# EAGLE design MystiqueJamma (EAGLE 9.1.0)
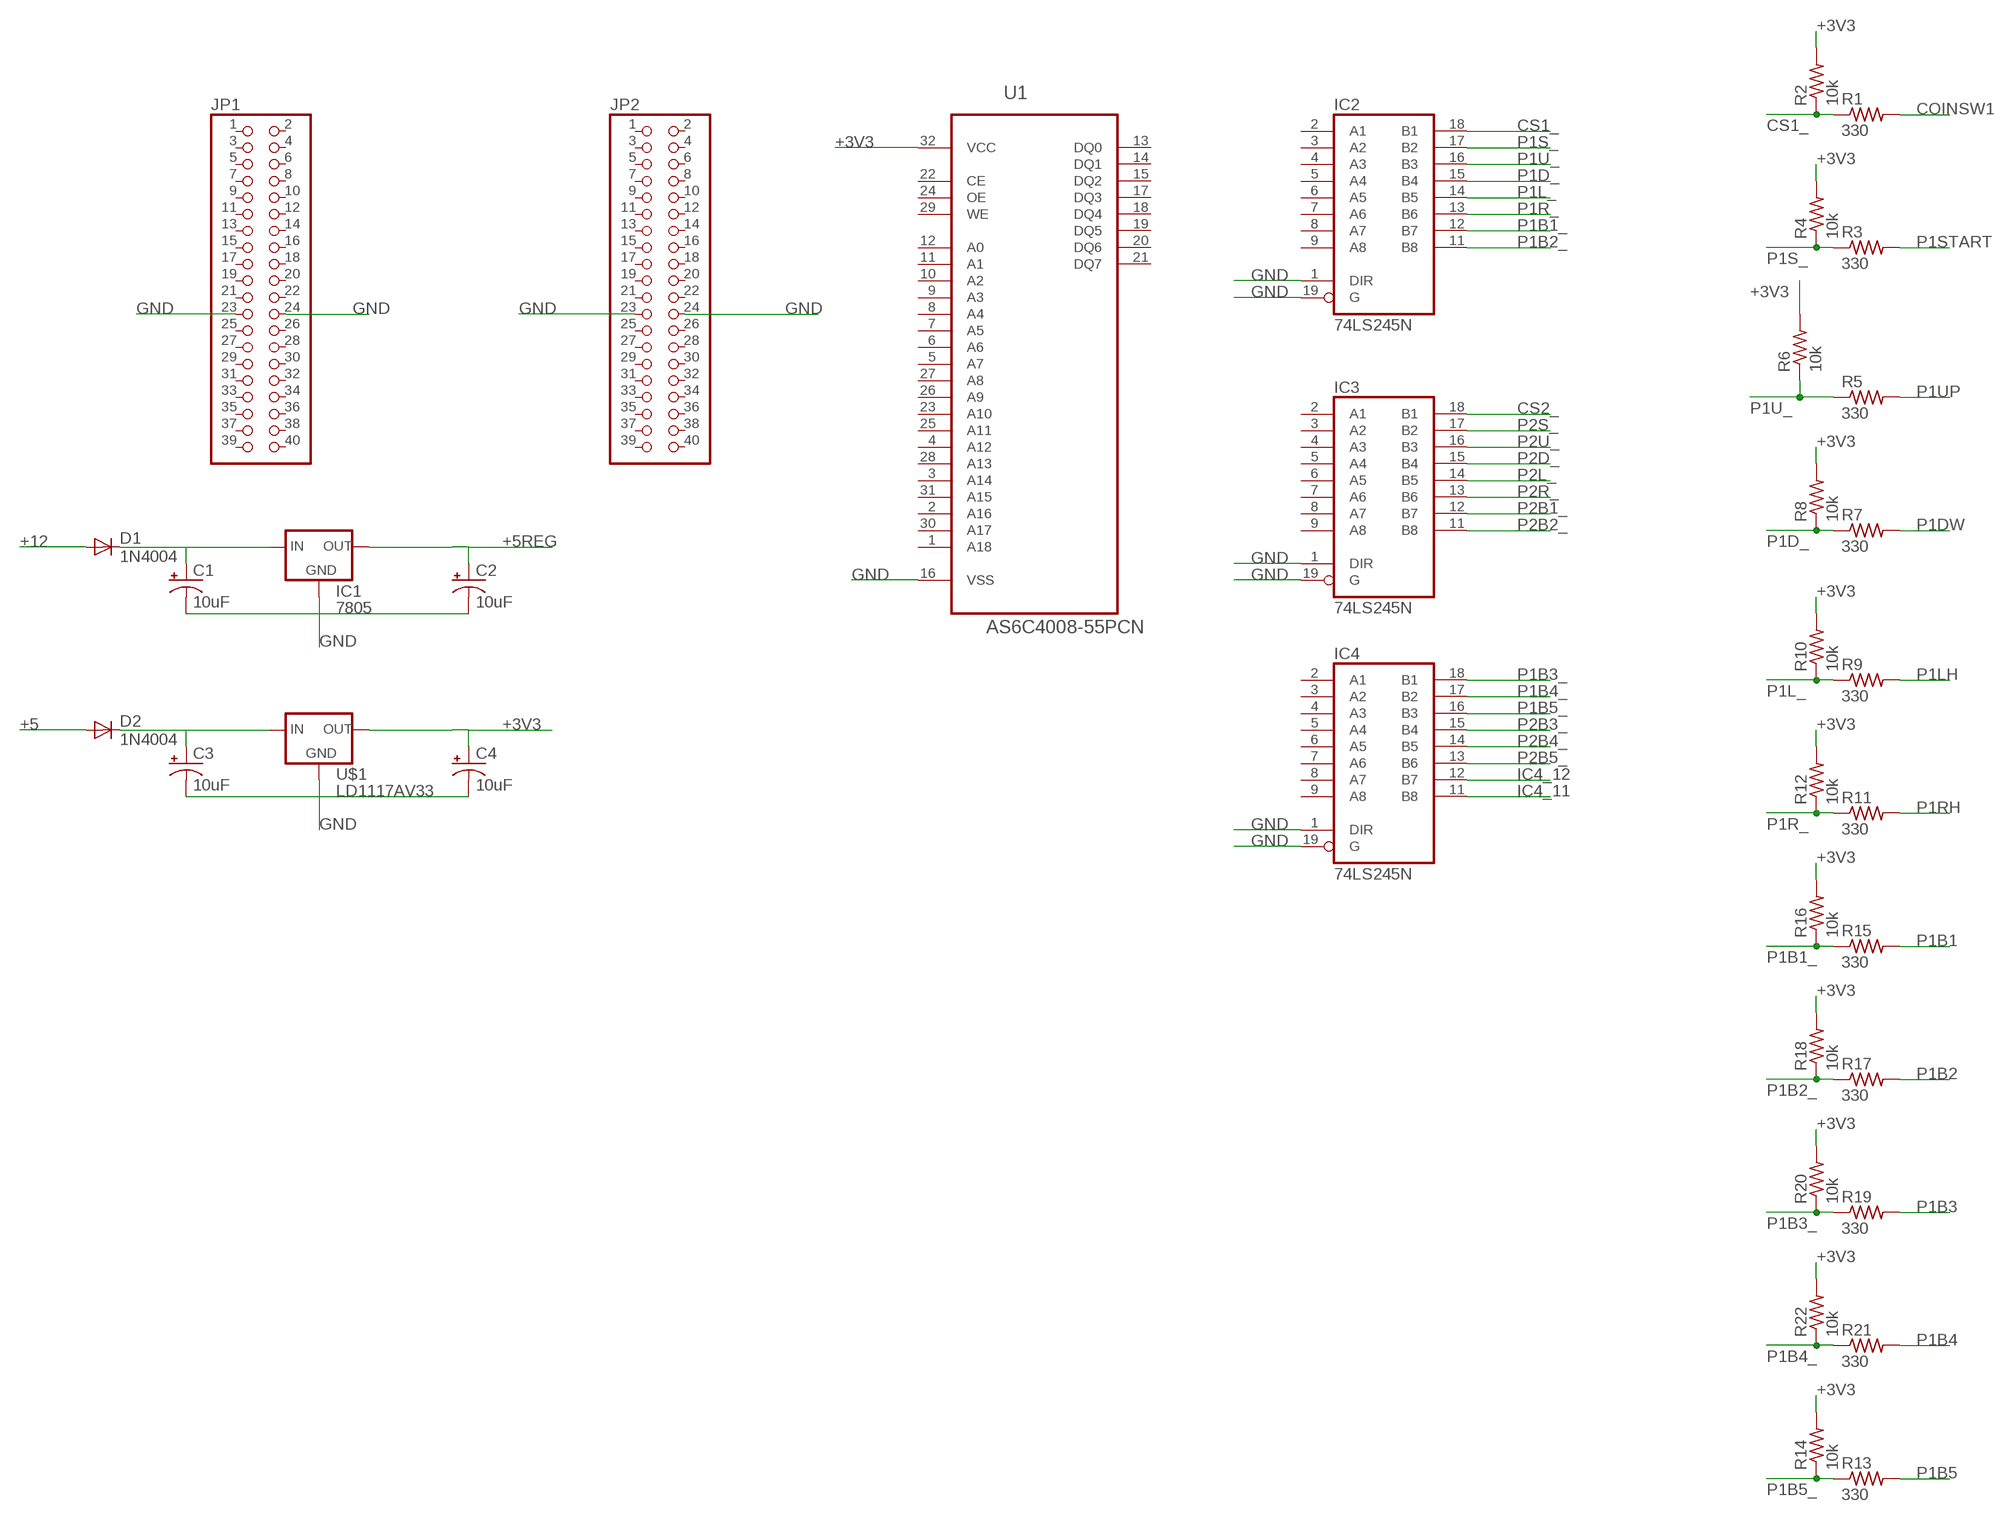
[diagram p0: schematic, sheet 1]

## Parts
C1  10uF  CPOL-USE2.5-5  [E2,5-5]
C2  10uF  CPOL-USE2.5-5  [E2,5-5]
C3  10uF  CPOL-USE2.5-5  [E2,5-5]
C4  10uF  CPOL-USE2.5-5  [E2,5-5]
D1  1N4004  [DO41-10]
D2  1N4004  [DO41-10]
IC1  7805  V_REG_78XXSINK  [TO220-IGO]
IC2  74LS245N  [DIL20]
IC3  74LS245N  [DIL20]
IC4  74LS245N  [DIL20]
JP1  PINHD-2X20  [2X20]
JP2  PINHD-2X20  [2X20]
R1  330  R-US_0207/7  [0207/7]
R2  10k  R-US_0207/7  [0207/7]
R3  330  R-US_0207/7  [0207/7]
R4  10k  R-US_0207/7  [0207/7]
R5  330  R-US_0207/7  [0207/7]
R6  10k  R-US_0207/7  [0207/7]
R7  330  R-US_0207/7  [0207/7]
R8  10k  R-US_0207/7  [0207/7]
R9  330  R-US_0207/7  [0207/7]
R10  10k  R-US_0207/7  [0207/7]
R11  330  R-US_0207/7  [0207/7]
R12  10k  R-US_0207/7  [0207/7]
R13  330  R-US_0207/7  [0207/7]
R14  10k  R-US_0207/7  [0207/7]
R15  330  R-US_0207/7  [0207/7]
R16  10k  R-US_0207/7  [0207/7]
R17  330  R-US_0207/7  [0207/7]
R18  10k  R-US_0207/7  [0207/7]
R19  330  R-US_0207/7  [0207/7]
R20  10k  R-US_0207/7  [0207/7]
R21  330  R-US_0207/7  [0207/7]
R22  10k  R-US_0207/7  [0207/7]
U1  AS6C4008-55PCN  [DIP254P1524X393-32]
U$1  LD1117AV33  V_REG_78XXSINK  [TO220-IGO]

## Nets
+3V3: C4.+ R2.2 R4.2 R6.2 R8.2 R10.2 R12.2 R14.2 R16.2 R18.2 R20.2 R22.2 U1.32(VCC) U$1.OUT
+5: D2.A
+5REG: C2.+ IC1.OUT
+12: D1.A
COINSW1: R1.2
CS1_: IC2.18(B1) R1.1 R2.1
CS2_: IC3.18(B1)
GND: C1.- C2.- C3.- C4.- IC1.GND IC2.1(DIR) IC2.19(G) IC3.1(DIR) IC3.19(G) IC4.1(DIR) IC4.19(G) JP1.23 JP1.24 JP2.23 JP2.24 U1.16(VSS) U$1.GND
IC4_11: IC4.11(B8)
IC4_12: IC4.12(B7)
N$1: C3.+ D2.C U$1.IN
N$2: C1.+ D1.C IC1.IN
P1B1: R15.2
P1B1_: IC2.12(B7) R15.1 R16.1
P1B2: R17.2
P1B2_: IC2.11(B8) R17.1 R18.1
P1B3: R19.2
P1B3_: IC4.18(B1) R19.1 R20.1
P1B4: R21.2
P1B4_: IC4.17(B2) R21.1 R22.1
P1B5: R13.2
P1B5_: IC4.16(B3) R13.1 R14.1
P1D_: IC2.15(B4) R7.1 R8.1
P1DW: R7.2
P1L_: IC2.14(B5) R9.1 R10.1
P1LH: R9.2
P1R_: IC2.13(B6) R11.1 R12.1
P1RH: R11.2
P1S_: IC2.17(B2) R3.1 R4.1
P1START: R3.2
P1U_: IC2.16(B3) R5.1 R6.1
P1UP: R5.2
P2B1_: IC3.12(B7)
P2B2_: IC3.11(B8)
P2B3_: IC4.15(B4)
P2B4_: IC4.14(B5)
P2B5_: IC4.13(B6)
P2D_: IC3.15(B4)
P2L_: IC3.14(B5)
P2R_: IC3.13(B6)
P2S_: IC3.17(B2)
P2U_: IC3.16(B3)
Unconnected: IC2.2(A1) IC2.3(A2) IC2.4(A3) IC2.5(A4) IC2.6(A5) IC2.7(A6) IC2.8(A7) IC2.9(A8) IC3.2(A1) IC3.3(A2) IC3.4(A3) IC3.5(A4) IC3.6(A5) IC3.7(A6) IC3.8(A7) IC3.9(A8) IC4.2(A1) IC4.3(A2) IC4.4(A3) IC4.5(A4) IC4.6(A5) IC4.7(A6) IC4.8(A7) IC4.9(A8) JP1.1 JP1.2 JP1.3 JP1.4 JP1.5 JP1.6 JP1.7 JP1.8 JP1.9 JP1.10 JP1.11 JP1.12 JP1.13 JP1.14 JP1.15 JP1.16 JP1.17 JP1.18 JP1.19 JP1.20 JP1.21 JP1.22 JP1.25 JP1.26 JP1.27 JP1.28 JP1.29 JP1.30 JP1.31 JP1.32 JP1.33 JP1.34 JP1.35 JP1.36 JP1.37 JP1.38 JP1.39 JP1.40 JP2.1 JP2.2 JP2.3 JP2.4 JP2.5 JP2.6 JP2.7 JP2.8 JP2.9 JP2.10 JP2.11 JP2.12 JP2.13 JP2.14 JP2.15 JP2.16 JP2.17 JP2.18 JP2.19 JP2.20 JP2.21 JP2.22 JP2.25 JP2.26 JP2.27 JP2.28 JP2.29 JP2.30 JP2.31 JP2.32 JP2.33 JP2.34 JP2.35 JP2.36 JP2.37 JP2.38 JP2.39 JP2.40 U1.1(A18) U1.2(A16) U1.3(A14) U1.4(A12) U1.5(A7) U1.6(A6) U1.7(A5) U1.8(A4) U1.9(A3) U1.10(A2) U1.11(A1) U1.12(A0) U1.13(DQ0) U1.14(DQ1) U1.15(DQ2) U1.17(DQ3) U1.18(DQ4) U1.19(DQ5) U1.20(DQ6) U1.21(DQ7) U1.22(CE) U1.23(A10) U1.24(OE) U1.25(A11) U1.26(A9) U1.27(A8) U1.28(A13) U1.29(WE) U1.30(A17) U1.31(A15)

## Power pins joined to a net without a drawn wire
GND: IC2.10(GND) IC3.10(GND) IC4.10(GND)
VCC: IC2.20(VCC) IC3.20(VCC) IC4.20(VCC)

## Library data of the parts
C1-C4 = rcl-2:CPOL-US: POLARIZED CAPACITOR, American symbol
D1 D2 = adafruit:1N4004: DIODE General purpose 1N400x type rectifier (With bigger pads) http://www.ladyada.net/library/pcb/eaglelibrary.html
IC1 = SparkFun:V_REG_78XX: Voltage Regulator Standard 7805 5V regulator. IGO (Input Ground Output). Spark Fun Electronics SKU : COM-00107
IC2-IC4 = 74xx-us:74*245: Octal BUS TRANSCEIVER, 3-state
JP1 JP2 = pinhead:PINHD-2X20: PIN HEADER
R1-R22 = adafruit:R-US_: RESISTOR, American symbol
U1 = Alliance_Memory_By_element14_Batch_1:AS6C4008-55PCN: CMOS SRAM; MPN: AS6C4008-55PCN; OC_FARNELL: 1562900; OC_NEWARK: 94M6217; PACKAGE: DIP-32; SUPPLIER: ALLIANCE MEMORY
U$1 = SparkFun-IC-Power:V_REG_78XX: Voltage Regulator Standard 78xx regulator. IGO (Input Ground Output). Spark Fun Electronics SKU : COM-00107

## Board
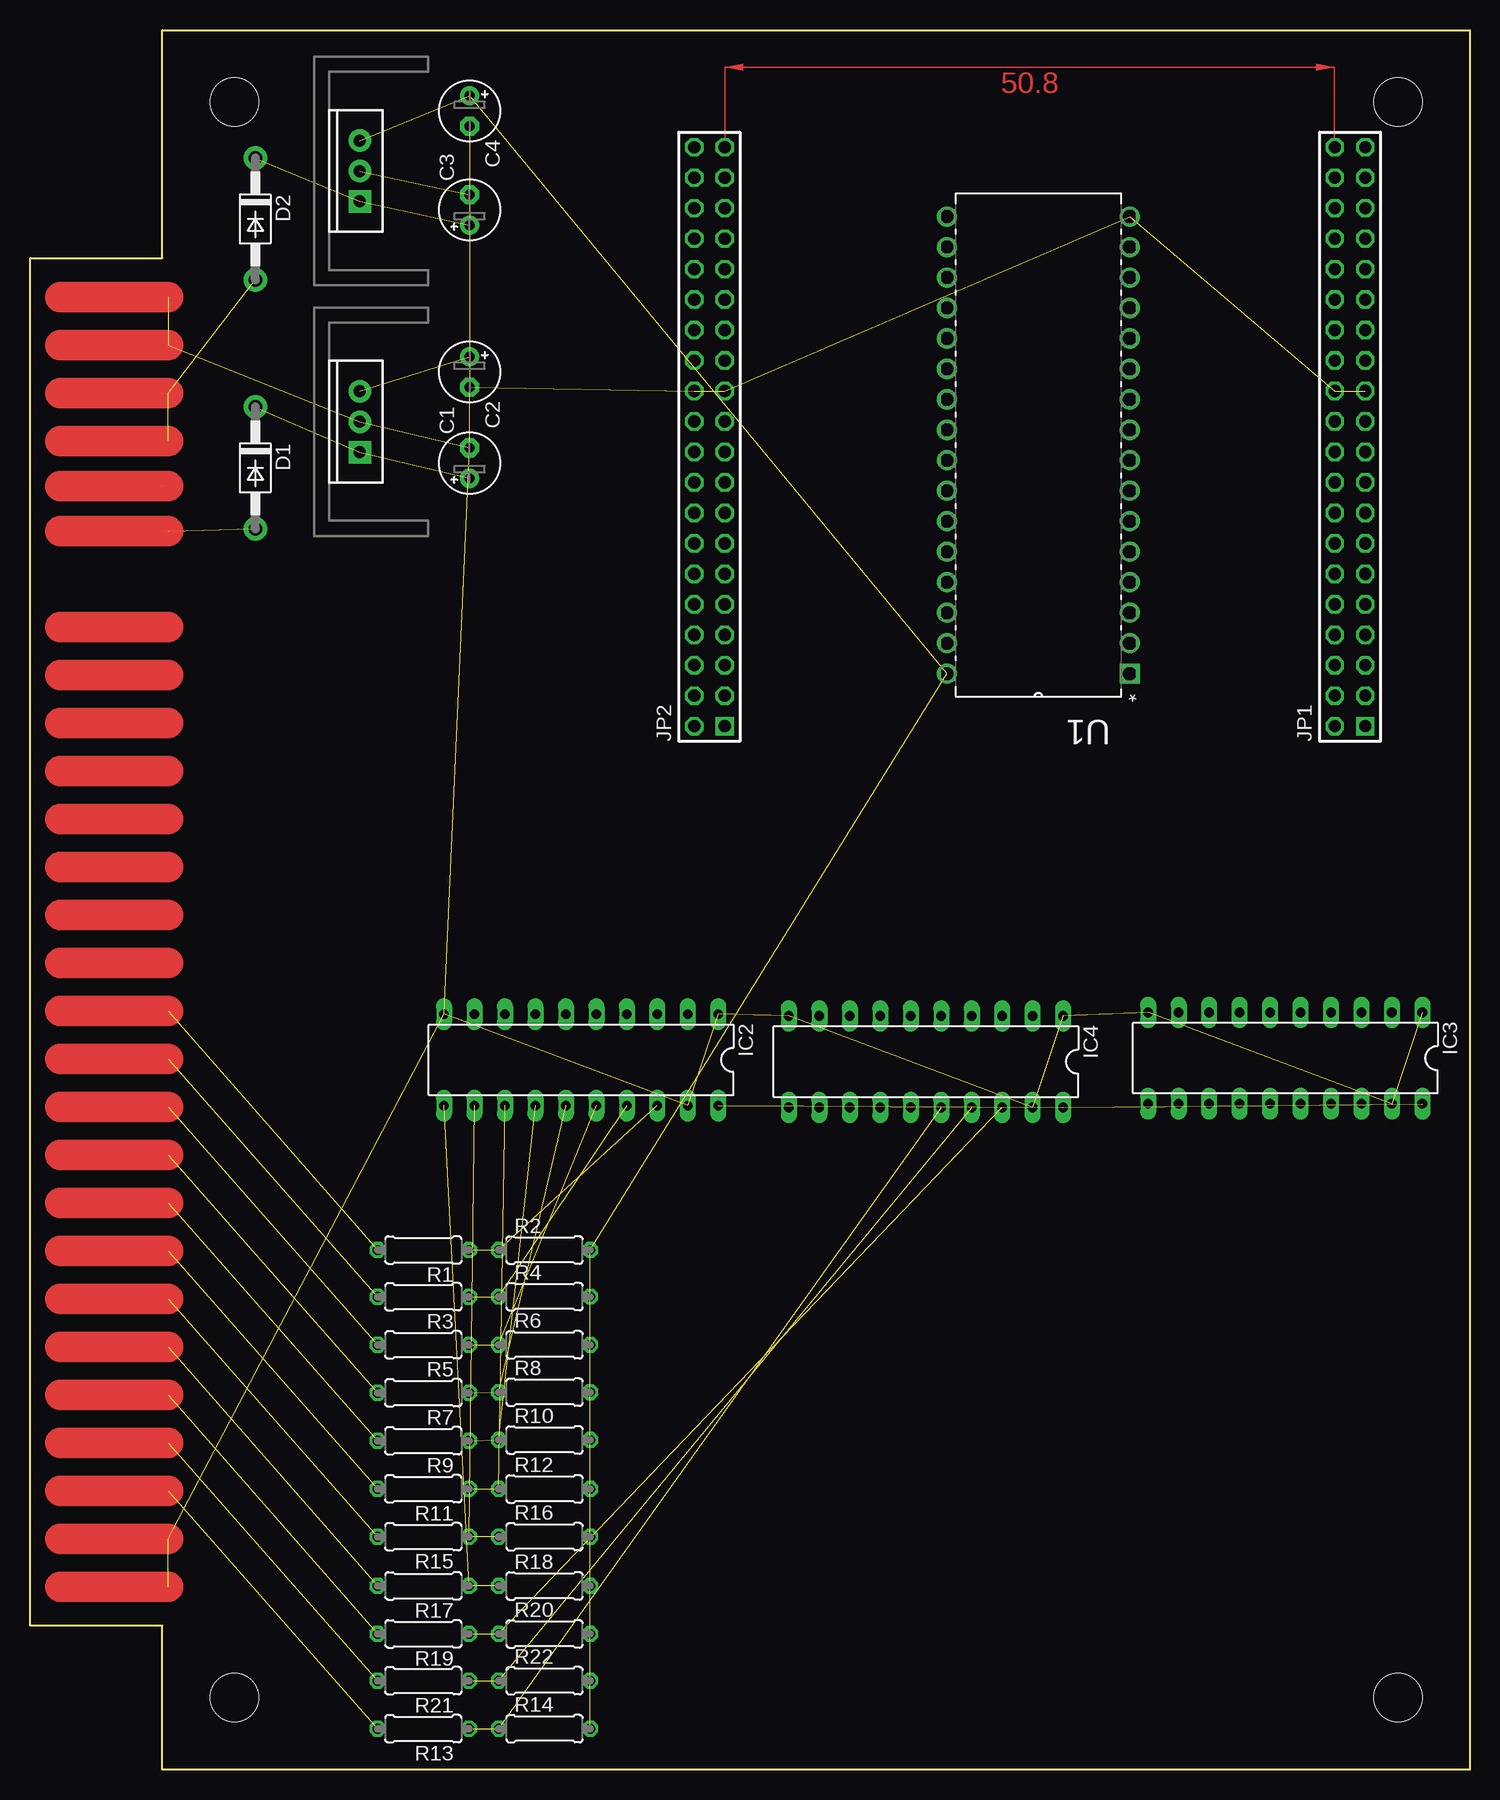
[diagram p1: board, top side]
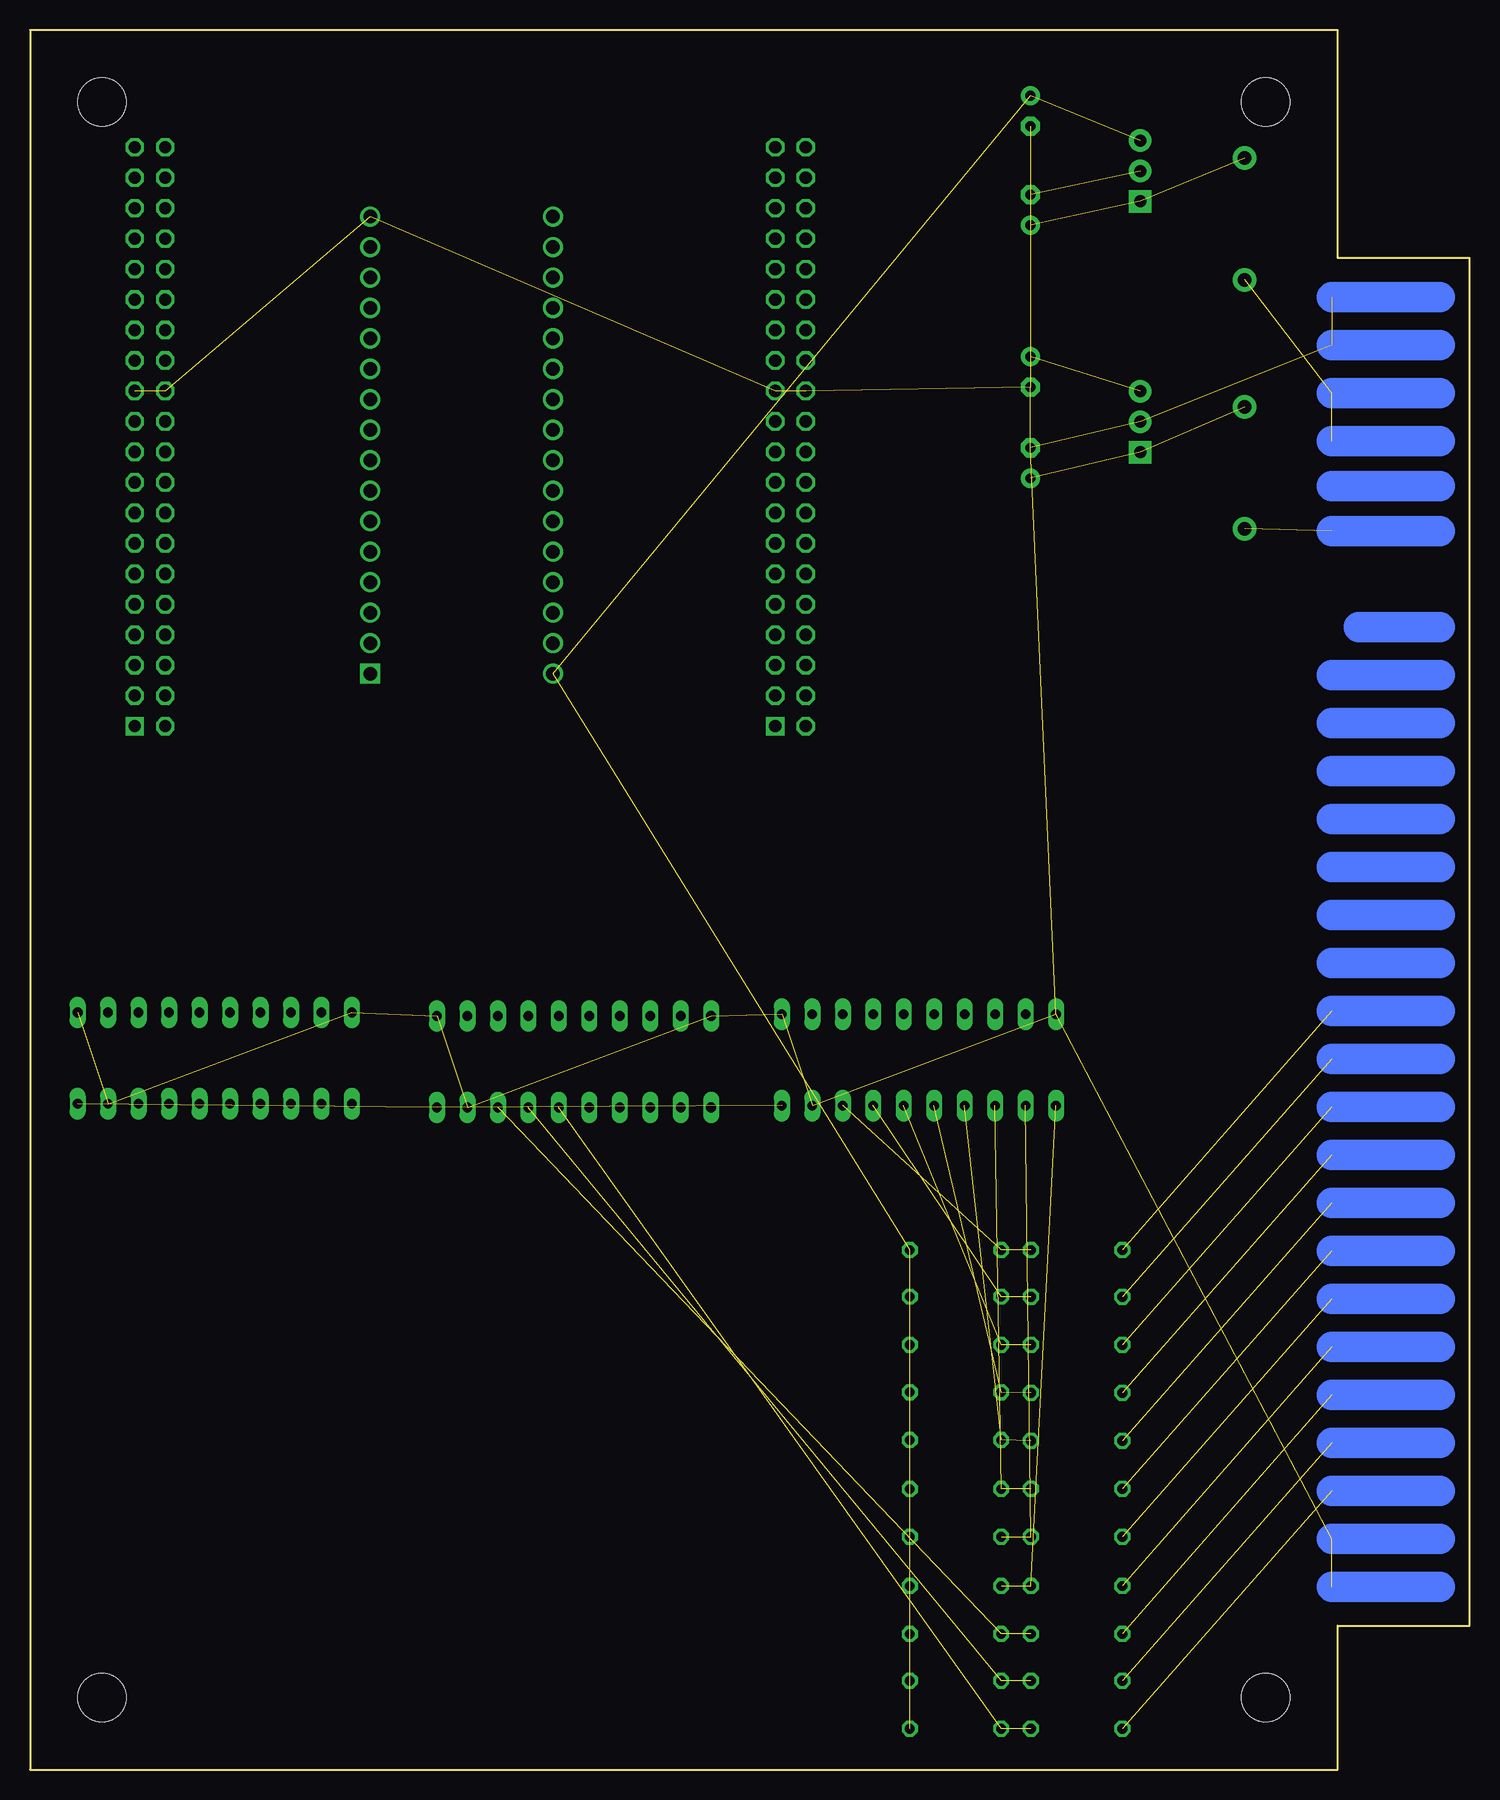
[diagram p2: board, bottom side, seen from below]

Size 120 x 145 mm. Coordinates in mm from the lower left corner, seen from the top.
Outline: 0,12 0,126 11,126 11,145 120,145 120,0 11,0 11,12 0,12
Copper layers (1*16): Top 0.035mm / dielectric 1.5mm / Bottom 0.035mm
Design rules "default": minimum track width 6mil, minimum drill 0.35mm, track to track 6mil, track to pad 6mil, pad to pad 6mil, via to via 6mil, smd to smd 6mil, copper to edge 40mil, drill to drill 6mil, minimum pad ring 10mil, minimum via ring 8mil, stop-mask expansion 4mil, vias tented up to drill 0mil, thermal gap 10mil
Holes 4 mm at 17,6 114,6 114,139 17,139

### Footprints (pad centres in the part's own frame; a part is rotated, then mirrored left to right if it is on the bottom)
E2,5-5 = drill 0.813 pad 1.6: + -1.27,0 | drill 0.813 pad 1.6 octagon: - 1.27,0
DO41-10 = drill 1.118 pad 1.93: A 5.08,0; C -5.08,0
TO220-IGO = drill 1 pad 1.88: GND 0,0; OUT 2.54,0 | drill 1 pad 1.88 square: IN -2.54,0
DIL20 = drill 0.813 long: 1 -11.43,-3.81; 2 -8.89,-3.81; 3 -6.35,-3.81; 4 -3.81,-3.81; 5 -1.27,-3.81; 6 1.27,-3.81; 7 3.81,-3.81; 8 6.35,-3.81; 9 8.89,-3.81; 10 11.43,-3.81; 11 11.43,3.81; 12 8.89,3.81; 13 6.35,3.81; 14 3.81,3.81; 15 1.27,3.81; 16 -1.27,3.81; 17 -3.81,3.81; 18 -6.35,3.81; 19 -8.89,3.81; 20 -11.43,3.81
2X20 = drill 1.016 square: 1 -24.13,-1.27 | drill 1.016 octagon: 2 -24.13,1.27; 3 -21.59,-1.27; 4 -21.59,1.27; 5 -19.05,-1.27; 6 -19.05,1.27; 7 -16.51,-1.27; 8 -16.51,1.27; 9 -13.97,-1.27; 10 -13.97,1.27; 11 -11.43,-1.27; 12 -11.43,1.27; 13 -8.89,-1.27; 14 -8.89,1.27; 15 -6.35,-1.27; 16 -6.35,1.27; 17 -3.81,-1.27; 18 -3.81,1.27; 19 -1.27,-1.27; 20 -1.27,1.27; 21 1.27,-1.27; 22 1.27,1.27; 23 3.81,-1.27; 24 3.81,1.27; 25 6.35,-1.27; 26 6.35,1.27; 27 8.89,-1.27; 28 8.89,1.27; 29 11.43,-1.27; 30 11.43,1.27; 31 13.97,-1.27; 32 13.97,1.27; 33 16.51,-1.27; 34 16.51,1.27; 35 19.05,-1.27; 36 19.05,1.27; 37 21.59,-1.27; 38 21.59,1.27; 39 24.13,-1.27; 40 24.13,1.27
0207/7 = drill 0.813 octagon: 1 -3.81,0; 2 3.81,0
DIP254P1524X393-32 = drill 1.118 square: 1 -15.24,38.1 | drill 1.118: 2 -15.24,35.56; 3 -15.24,33.02; 4 -15.24,30.48; 5 -15.24,27.94; 6 -15.24,25.4; 7 -15.24,22.86; 8 -15.24,20.32; 9 -15.24,17.78; 10 -15.24,15.24; 11 -15.24,12.7; 12 -15.24,10.16; 13 -15.24,7.62; 14 -15.24,5.08; 15 -15.24,2.54; 16 -15.24,0; 17 0,0; 18 0,2.54; 19 0,5.08; 20 0,7.62; 21 0,10.16; 22 0,12.7; 23 0,15.24; 24 0,17.78; 25 0,20.32; 26 0,22.86; 27 0,25.4; 28 0,27.94; 29 0,30.48; 30 0,33.02; 31 0,35.56; 32 0,38.1

### Placement (x,y rotation side)
C1  36.6,108.9 90 top
C2  36.6,116.5 270 top
C3  36.6,130 90 top
C4  36.6,138.25 270 top
D1  18.75,108.5 270 top
D2  18.75,129.25 270 top
IC1  27.45,112.35 90 top
IC2  45.9,59.15 180 top
IC3  104.6,59.3 180 top
IC4  74.65,59 180 top
JP1  110,111.1 90 top
JP2  56.6,111.1 90 top
R1  32.75,43.3 180 top
R2  42.85,43.3 0 top
R3  32.75,39.4 180 top
R4  42.85,39.42 0 top
R5  32.75,35.4 180 top
R6  42.85,35.4 0 top
R7  32.75,31.4 180 top
R8  42.85,31.45 0 top
R9  32.75,27.4 180 top
R10  42.85,27.47 0 top
R11  32.75,23.4 180 top
R12  42.85,23.38 0 top
R13  32.75,3.4 180 top
R14  42.85,3.4 0 top
R15  32.75,19.4 180 top
R16  42.85,19.4 0 top
R17  32.75,15.3 180 top
R18  42.85,15.3 0 top
R19  32.75,11.3 180 top
R20  42.85,11.3 0 top
R21  32.75,7.4 180 top
R22  42.85,7.4 0 top
U1  76.4,129.45 180 top
U$1  27.45,133.25 90 top

### Tracks (layer width: path | path; a pad name or v marks a point on that pad's centre or on a via)
+3V3  (13 unrouted)
+5  (4 unrouted)
  Top 2.54: 2.5,114.75 7.01,114.75 11,114.75 11.5,114.75 | 11.5,110.75 7.01,110.75 2.5,110.75
  Bottom 2.54: 2.5,114.75 7.01,114.75 11,114.75 11.5,114.75 | 11.5,110.75 7.01,110.75 2.5,110.75
+5REG  (1 unrouted)
+12  (2 unrouted)
  Top 2.54: 2.5,103.25 10.97,103.25 11,103.25 11.25,103.25 11.5,103.25
  Bottom 2.54: 2.5,103.25 10.97,103.25 11,103.25 11.25,103.25 11.5,103.25
-5  (1 unrouted)
  Top 2.54: 2.5,107 6.86,107 11,107 11.5,107
  Bottom 2.54: 2.5,107 6.86,107 11,107 11.5,107
AUDIOGS
  Bottom 2.54: 2.5,83.25 11.5,83.25
COINCOUNTER1
  Top 2.54: 2.5,95.25 11.5,95.25
COINCOUNTER2
  Bottom 2.54: 2.5,95.25 9.25,95.25
COINSW1  (1 unrouted)
  Top 2.54: 2.5,63.25 11.5,63.25
COINSW2
  Bottom 2.54: 2.5,63.25 11.5,63.25
CS1_  (2 unrouted)
GND  (27 unrouted)
  Top 2.54: 2.5,19.25 6.86,19.25 7.01,19.25 11,19.25 11.5,19.25 | 11.5,15.25 7.01,15.25 2.5,15.25 | 2.5,122.75 6.86,122.75 7.01,122.75 11,122.75 11.5,122.75 | 11.5,118.75 7.01,118.75 2.5,118.75
  Bottom 2.54: 11.5,15.25 6.71,15.25 2.5,15.25 | 2.5,19.25 6.71,19.25 6.86,19.25 11,19.25 11.5,19.25 | 11.5,122.75 11,122.75 10.97,122.75 6.86,122.75 6.71,122.75 2.5,122.75 | 11.5,118.75 6.71,118.75 2.5,118.75
LOCKOUTCOIL1
  Top 2.54: 2.5,91.25 11.5,91.25
LOCKOUTCOIL2
  Bottom 2.54: 2.5,91.25 11.5,91.25
N$1  (2 unrouted)
N$2  (2 unrouted)
P1B1  (1 unrouted)
  Top 2.54: 2.5,39.25 11.5,39.25
P1B1_  (2 unrouted)
P1B2  (1 unrouted)
  Top 2.54: 2.5,35.25 11.5,35.25
P1B2_  (2 unrouted)
P1B3  (1 unrouted)
  Top 2.54: 2.5,31.25 11.5,31.25
P1B3_  (2 unrouted)
P1B4  (1 unrouted)
  Top 2.54: 2.5,27.25 11.5,27.25
P1B4_  (2 unrouted)
P1B5  (1 unrouted)
  Top 2.54: 2.5,23.25 11.5,23.25
P1B5_  (2 unrouted)
P1D_  (2 unrouted)
P1DW  (1 unrouted)
  Top 2.54: 2.5,51.25 11.5,51.25
P1L_  (2 unrouted)
P1LH  (1 unrouted)
  Top 2.54: 2.5,47.25 11.5,47.25
P1R_  (2 unrouted)
P1RH  (1 unrouted)
  Top 2.54: 2.5,43.25 11.5,43.25
P1S_  (2 unrouted)
P1START  (1 unrouted)
  Top 2.54: 2.5,59.25 11.5,59.25
P1U_  (2 unrouted)
P1UP  (1 unrouted)
  Top 2.54: 2.5,55.25 11.5,55.25
P2B1
  Bottom 2.54: 2.5,39.25 11.5,39.25
P2B2
  Bottom 2.54: 2.5,35.25 11.5,35.25
P2B3
  Bottom 2.54: 2.5,31.25 11.5,31.25
P2B4
  Bottom 2.54: 2.5,27.25 11.5,27.25
P2B5
  Bottom 2.54: 2.5,23.25 11.5,23.25
P2DW
  Bottom 2.54: 2.5,51.25 11.5,51.25
P2LH
  Bottom 2.54: 2.5,47.25 11.5,47.25
P2RH
  Bottom 2.54: 2.5,43.25 11.5,43.25
P2START
  Bottom 2.54: 2.5,59.25 11.5,59.25
P2UP
  Bottom 2.54: 2.5,55.25 11.5,55.25
S$11
  Top 2.54: 2.5,83.25 11.5,83.25
SERVSW
  Bottom 2.54: 2.5,71.25 11.5,71.25
SPEAKER+
  Top 2.54: 2.5,87.25 11.5,87.25
SPEAKER-
  Bottom 2.54: 2.5,87.25 11.5,87.25
TESTSW
  Top 2.54: 2.5,67.25 11.5,67.25
TILTSW
  Bottom 2.54: 2.5,67.25 11.5,67.25
VCC  (2 unrouted)
VIDEOBLUE
  Top 2.54: 2.5,75.25 11.5,75.25
VIDEOGND
  Top 2.54: 2.5,71.25 11.5,71.25
VIDEOGR
  Bottom 2.54: 2.5,79.25 11.5,79.25
VIDEORED
  Top 2.54: 2.5,79.25 11.5,79.25
VIDEOSYN
  Bottom 2.54: 2.5,75.25 11.5,75.25
(copper drawn outside any net)
  shapes: Top area x1

### Text on the board
tDocu: 40 (30) 39 (28) / 38 (32) 37 (31) / 36 (NC) 35 (33) / 34 (39) 33 (NC) / 32 (43) 31 (42) / 30 (46) 29 (44) / 28 (50) 27 (49) / 26 (52) 25 (51) / 24 (GND) 23 (GND) / 22 (54) 21 (53) / 20 (58) 19 (55) / 18 (60) 17 (59) / 16 (65) 15 (64) / 14 (67) 13 (66) / 12 (69) 11 (68) / 10 (71) 09 (NC) / 08 (88) 07 (72) / 06 (90) 05 (89) / 04 (99) 03 (91) / 02 (VCC) 01 (100) | 40 (10) 39 (11) / 38 (NC) 37 (7) / 36 (NC) 35 (NC) / 34 (143) 33 (144) / 32 (141) 31 (142) / 30 (137) 29 (NC) / 28 (135) 27 (136) / 26 (132) 25 (133) / 24 (GND) 23 (GND) / 22 (129) 21 (128) / 20 (127) 19 (126) / 18 (125) 17 (NC) / 16 (121) 15 (120) / 14 (119) 13 (115) / 12 (114) 11 (113) / 10 (112) 09 (111) / 08 (110) 07 (106) / 06 (105) 05 (104) / 04 (103) 03 (101) / 02 (I/0) 01 (Vcc)